# Altium schematic sheet STM32F103C8T61.SchDoc
size A4
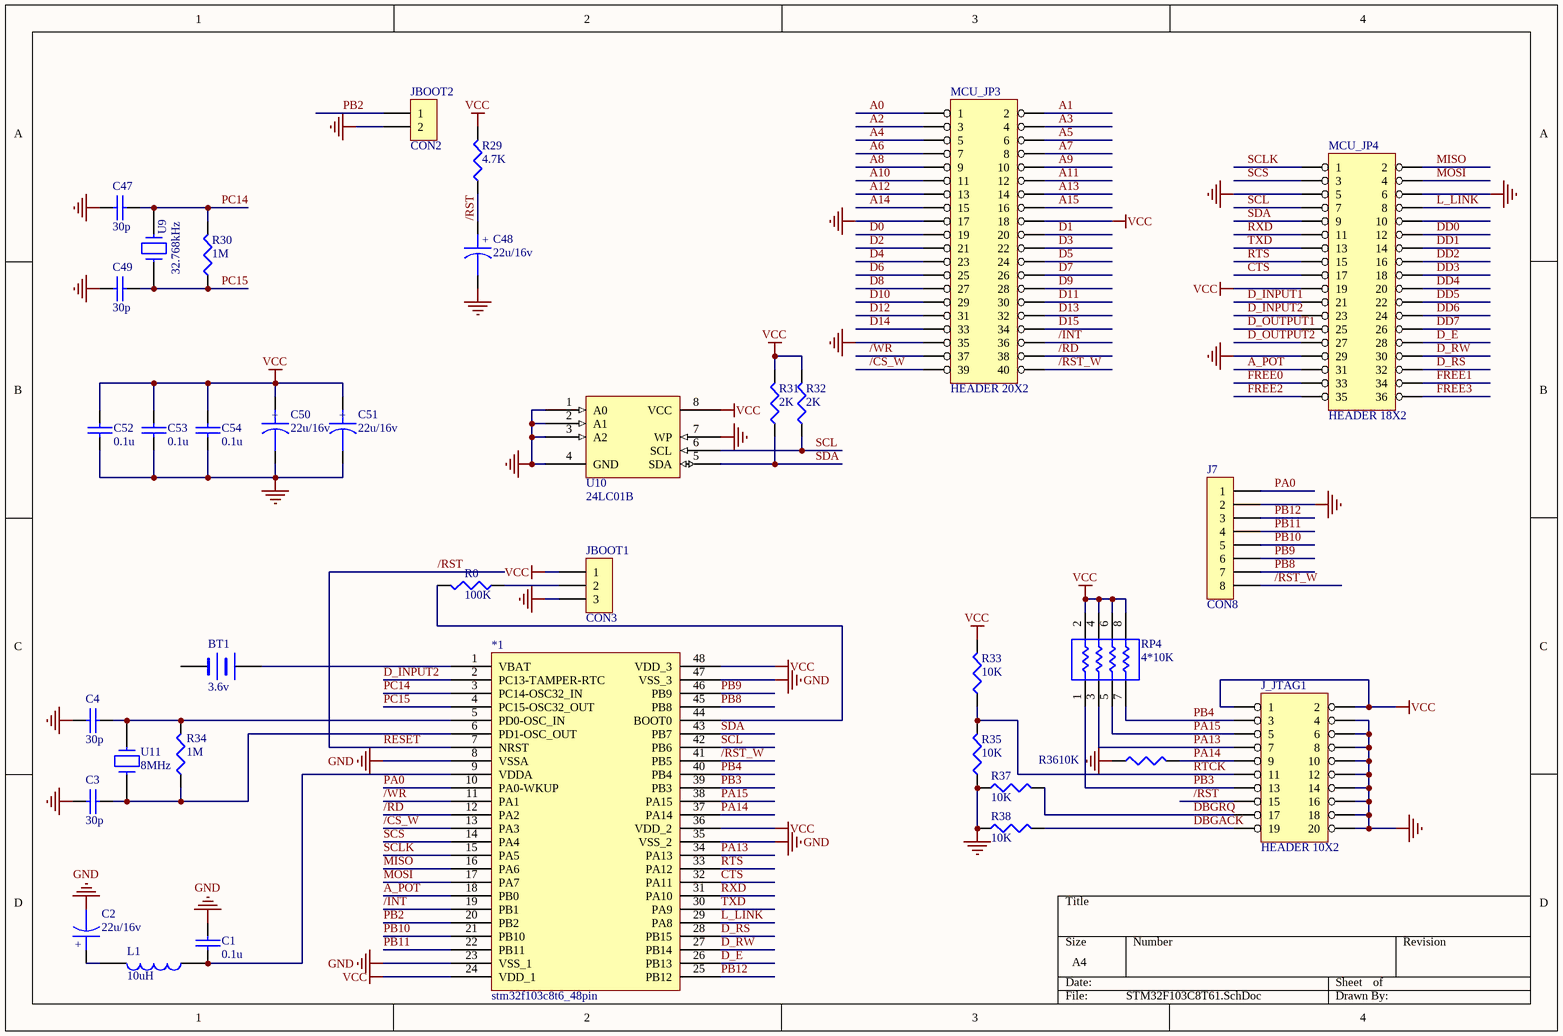
[diagram p0: STM32F103C8T61.SchDoc]

## Parts
*1  stm32f103c8t6_48pin
BT1  3.6v  [BAT_JACK1]
C1  0.1u  [0603]
C2  22u/16v  [RB.1/.2N]
C3  30p  [0603]
C4  30p  [0603]
C47  30p  [0603]
C48  22u/16v  [RB.1/.2N]
C49  30p  [0603]
C50  22u/16v  [RB.1/.2N]
C51  22u/16v  [RB.1/.2N]
C52  0.1u  [0603]
C53  0.1u  [0603]
C54  0.1u  [0603]
J7  CON8  [SIP8]
J_JTAG1  HEADER 10X2  [IDC20]
JBOOT1  CON3  [SIP3]
JBOOT2  CON2  [SIP2]
L1  10uH  [0603]
MCU_JP3  HEADER 20X2  [IDC40-2]
MCU_JP4  HEADER 18X2  [IDC36-2]
R0  100K  [0603]
R29  4.7K  [0603]
R30  1M  [0603]
R31  2K  [0603]
R32  2K  [0603]
R33  10K  [0603]
R34  1M  [0603]
R35  10K  [0603]
R36  10K  [0603]
R37  10K  [0603]
R38  10K  [0603]
RP4  4*10K  [4X0603]
U9  32.768kHz  [XTAL2]
U10  24LC01B  [DIP8]
U11  8MHz  [XTAL]

## Nets
GND: *1.8(VSSA) *1.23(VSS_1) *1.35(VSS_2) *1.47(VSS_3) C1.2 C3.2 C4.2 C47.2 C48.2 C49.2 C50.2 C51.2 C52.2 C53.1 C54.1 J7.2 J_JTAG1.4 J_JTAG1.6 J_JTAG1.8 J_JTAG1.10 J_JTAG1.12 J_JTAG1.14 J_JTAG1.16 J_JTAG1.18 J_JTAG1.20 JBOOT1.3 JBOOT2.2 MCU_JP3.17 MCU_JP3.35 MCU_JP4.5 MCU_JP4.6 MCU_JP4.29 R35.1 R36.1 R37.1 R38.1 U10.1(A0) U10.2(A1) U10.3(A2) U10.4(GND) U10.7(WP)
VCC: *1.24(VDD_1) *1.36(VDD_2) *1.48(VDD_3) C50.1 C51.1 C52.1 C53.2 C54.2 J_JTAG1.1 J_JTAG1.2 JBOOT1.1 MCU_JP3.18 MCU_JP4.19 R29.2 R31.2 R32.2 R33.2 RP4.2 RP4.4 RP4.6 RP4.8 U10.8(VCC)
/CS_W: *1.13(PA3) MCU_JP3.39
/INT: *1.19(PB1) MCU_JP3.36
/RD: *1.12(PA2) MCU_JP3.38
/RST: *1.7(NRST) C48.1 J_JTAG1.15 R29.1  [also labelled RESET]
/RST_W: *1.41(PB5) J7.8 MCU_JP3.40
/WR: *1.11(PA1) MCU_JP3.37
A0: MCU_JP3.1
A1: MCU_JP3.2
A2: MCU_JP3.3
A3: MCU_JP3.4
A4: MCU_JP3.5
A5: MCU_JP3.6
A6: MCU_JP3.7
A7: MCU_JP3.8
A8: MCU_JP3.9
A9: MCU_JP3.10
A10: MCU_JP3.11
A11: MCU_JP3.12
A12: MCU_JP3.13
A13: MCU_JP3.14
A14: MCU_JP3.15
A15: MCU_JP3.16
A_POT: *1.18(PB0) MCU_JP4.31
CTS: *1.32(PA11) MCU_JP4.17
D0: MCU_JP3.19
D1: MCU_JP3.20
D2: MCU_JP3.21
D3: MCU_JP3.22
D4: MCU_JP3.23
D5: MCU_JP3.24
D6: MCU_JP3.25
D7: MCU_JP3.26
D8: MCU_JP3.27
D9: MCU_JP3.28
D10: MCU_JP3.29
D11: MCU_JP3.30
D12: MCU_JP3.31
D13: MCU_JP3.32
D14: MCU_JP3.33
D15: MCU_JP3.34
D_E: *1.26(PB13) MCU_JP4.28
D_INPUT1: MCU_JP4.21
D_INPUT2: *1.2(PC13-TAMPER-RTC) MCU_JP4.23
D_OUTPUT1: MCU_JP4.25
D_OUTPUT2: MCU_JP4.27
D_RS: *1.28(PB15) MCU_JP4.32
D_RW: *1.27(PB14) MCU_JP4.30
DBGACK: J_JTAG1.19 R38.2
DBGRQ: J_JTAG1.17 R37.2
DD0: MCU_JP4.12
DD1: MCU_JP4.14
DD2: MCU_JP4.16
DD3: MCU_JP4.18
DD4: MCU_JP4.20
DD5: MCU_JP4.22
DD6: MCU_JP4.24
DD7: MCU_JP4.26
FREE0: MCU_JP4.33
FREE1: MCU_JP4.34
FREE2: MCU_JP4.35
FREE3: MCU_JP4.36
L_LINK: *1.29(PA8) MCU_JP4.8
MISO: *1.16(PA6) MCU_JP4.2
MOSI: *1.17(PA7) MCU_JP4.4
PA0: *1.10(PA0-WKUP) J7.1
PA13: *1.34(PA13) J_JTAG1.7 RP4.3
PA14: *1.37(PA14) J_JTAG1.9 R36.2
PA15: *1.38(PA15) J_JTAG1.5 RP4.5
PB2: *1.20(PB2) JBOOT2.1
PB3: *1.39(PB3) J_JTAG1.13 RP4.1
PB4: *1.40(PB4) J_JTAG1.3 RP4.7
PB8: *1.45(PB8) J7.7
PB9: *1.46(PB9) J7.6
PB10: *1.21(PB10) J7.5
PB11: *1.22(PB11) J7.4
PB12: *1.25(PB12) J7.3
PC14: *1.3(PC14-OSC32_IN) C47.1 R30.2 U9.1
PC15: *1.4(PC15-OSC32_OUT) C49.1 R30.1 U9.2
RTCK: J_JTAG1.11 R33.1 R35.2
RTS: *1.33(PA12) MCU_JP4.15
RXD: *1.31(PA10) MCU_JP4.11
SCL: *1.42(PB6) MCU_JP4.7 R32.1 U10.6(SCL)
SCLK: *1.15(PA5) MCU_JP4.1
SCS: *1.14(PA4) MCU_JP4.3
SDA: *1.43(PB7) MCU_JP4.9 R31.1 U10.5(SDA)
TXD: *1.30(PA9) MCU_JP4.13
Net*1_1: *1.1(VBAT) BT1.1(+)
Net*1_5: *1.5(PD0-OSC_IN) C4.1 R34.1 U11.2
Net*1_6: *1.6(PD1-OSC_OUT) C3.1 R34.2 U11.1
Net*1_9: *1.9(VDDA) C1.1 L1.1
Net*1_44: *1.44(BOOT0) R0.2
NetC2_1: C2.1 L1.2
NetJBOOT1_2: JBOOT1.2 R0.1

Not connected (* = marked no-connect by the designer): BT1 2(-); C2 2; MCU_JP4 10

## Notes on the sheet
- Labels drawn without touching a wire or pin: GND
- (in symbol CAPACITOR POL) +

## Library data of the parts
BT1 = BATTERY
C1 C3 C4 C47 C49 C52-C54 = CAP: Capacitor
C2 C48 C50 C51 = CAPACITOR POL: Capacitor
J7 = CON8: Connector
JBOOT1 = CON3: Connector
JBOOT2 = CON2: Connector
L1 = INDUCTOR
R0 R29-R38 = RES1
RP4 = RES-4: RP?
U9 U11 = CRYSTAL
U10 = 24AA01